# EasyEDA schematic 1-Schematic_Purple Eye.json
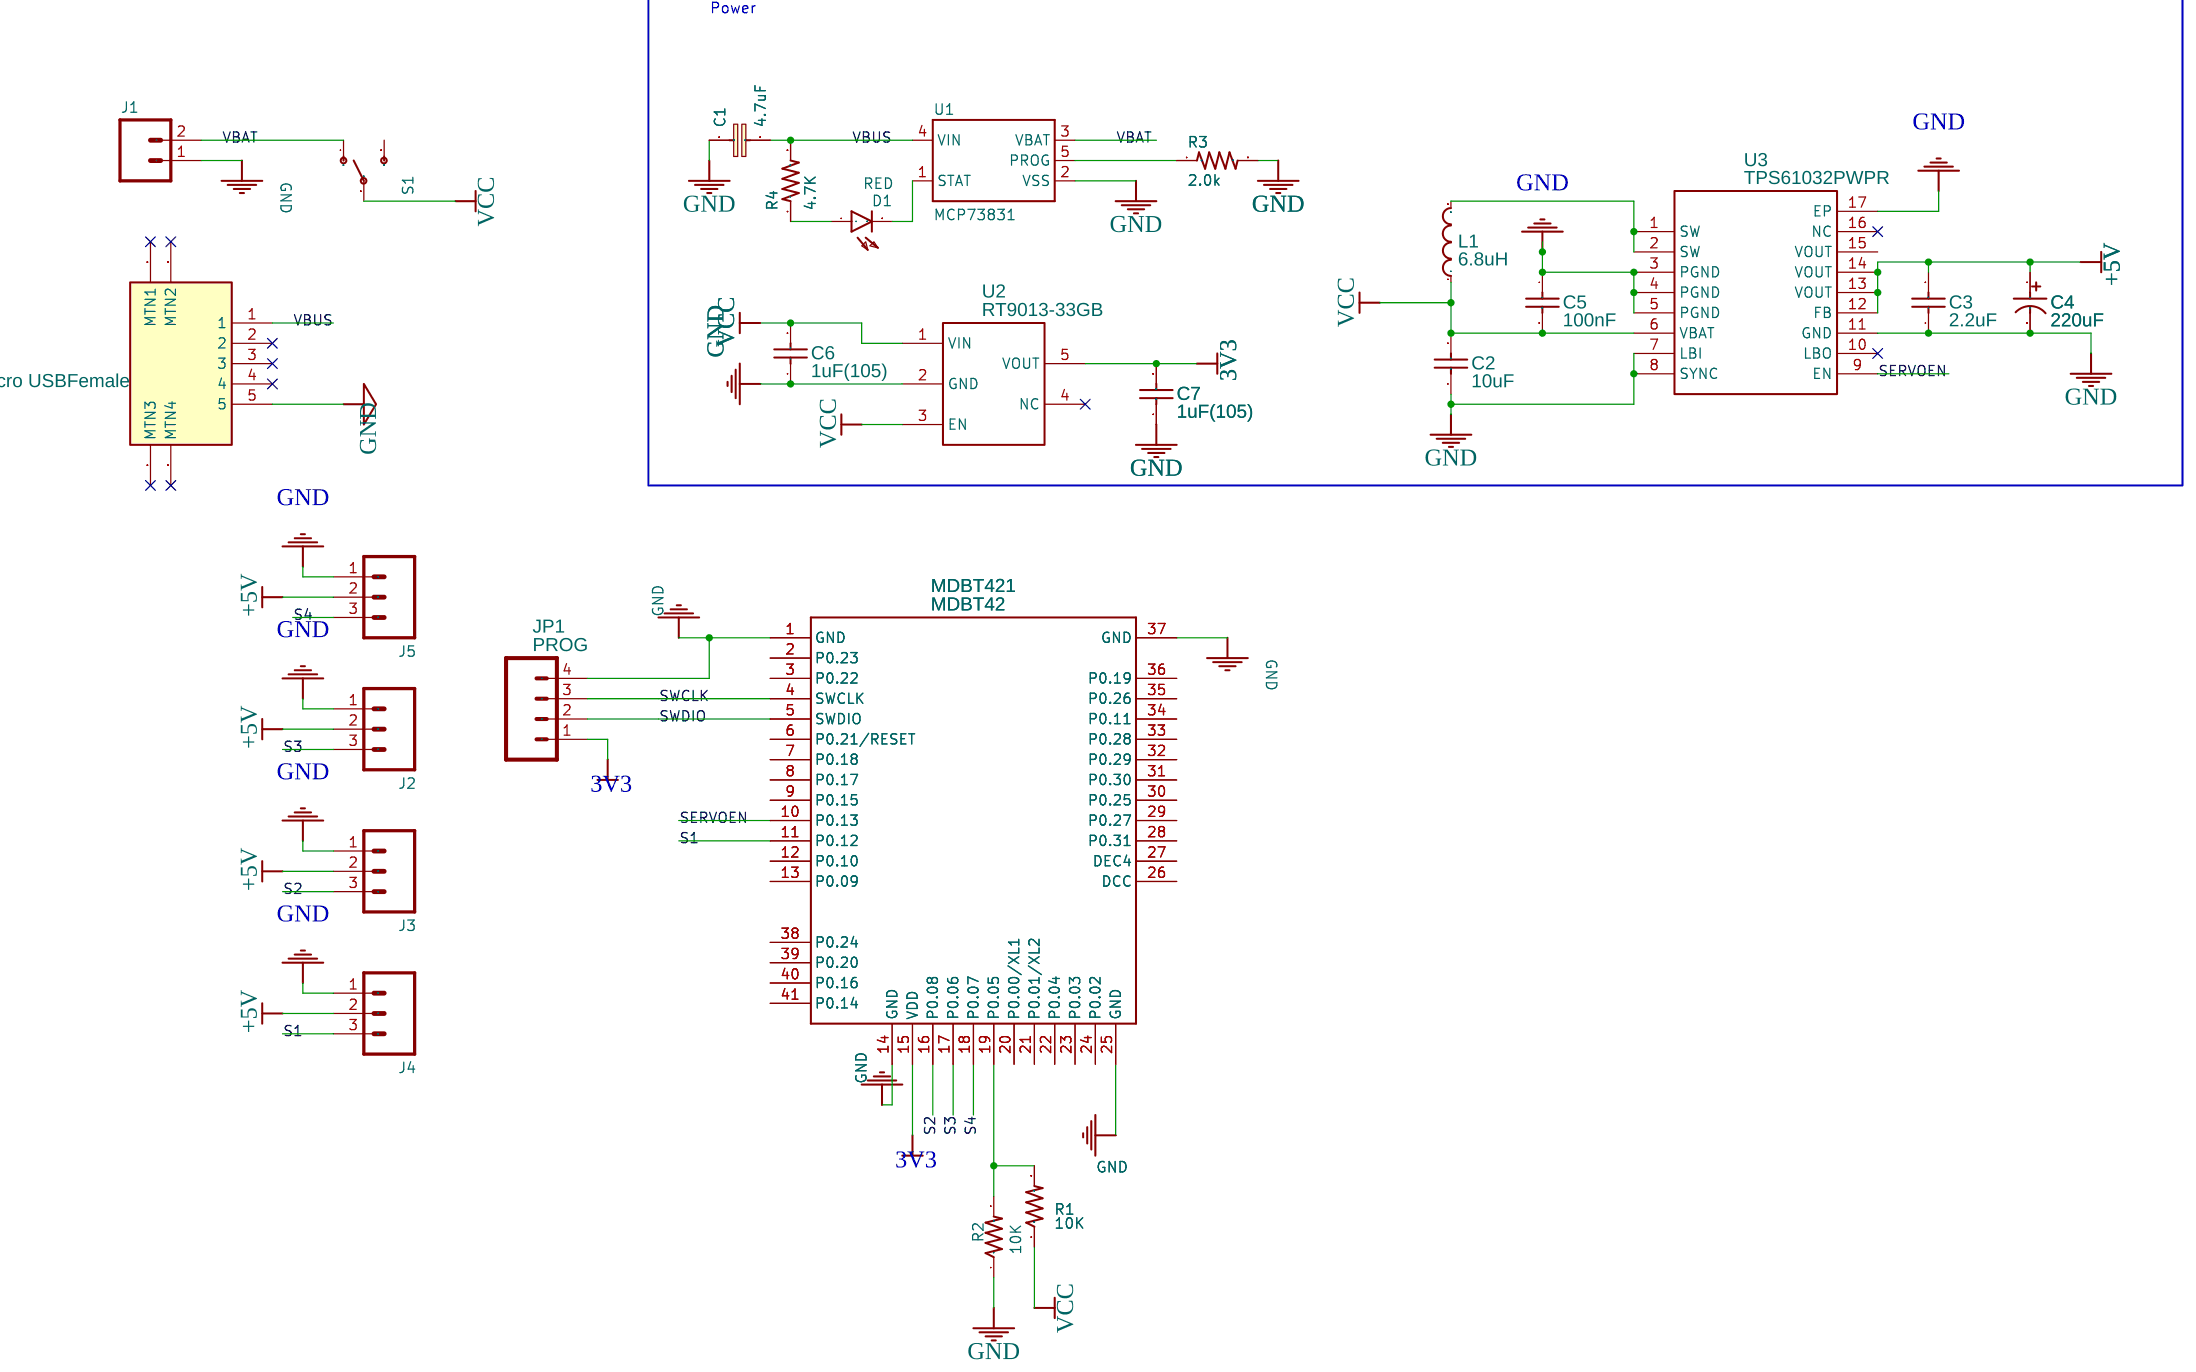
[diagram p0: schematic sheet]

## Parts
C1  4.7uF  [0603]
C2  10uF  [0603]
C3  2.2uF  [0603]
C4  220uF  [CASE-C_6032]
C5  100nF  [0603]
C6  1uF(105)  [0603]
C7  1uF(105)  [0603]
D1  RED  [LED_0603]
J1  M02JST-PTH-2  [JST-2-PTH]
J2  M03LOCK  [1X03_LOCK]
J3  M03LOCK  [1X03_LOCK]
J4  M03LOCK  [1X03_LOCK]
J5  M03LOCK  [1X03_LOCK]
J7  micro USBFemale  [MICRO-USB-1]
JP1  PROG  [1X04_LOCK]
L1  6.8uH  [CDRH103]
MDBT421  MDBT42  [MDBT42]
R1  10K  [0603]
R2  10K  [0603]
R3  2.0k  [0603]
R4  4.7K  [0603]
S1  SWITCH-SPDTPTH_LOCK  [SWITCH-SPDT_LOCK.007S]
U1  MCP73831  [SOT23-5]
U2  RT9013-33GB  [SOT-23-5]
U3  TPS61032PWPR  [HTSSOP-16]

## Library data of the parts
C2 = CL10A475MQ8NNNC: Supplier: LCSC; Manufacturer: SAMSUNG; Contributor: LCSC; Supplier Part: C154959
C3 = CL10A225KP8NNNC: Supplier: LCSC; Manufacturer: SAMSUNG; Supplier Part: C1607
C4 = T491C227K006AT: Supplier: LCSC; Manufacturer: KEMET; Contributor: LCSC; Supplier Part: C117035
C5 = C0603C104K5RACTU: Supplier: LCSC; Manufacturer: KEMET; Contributor: LCSC; Supplier Part: C127833
C6 C7 = 0603B105K160: Supplier: LCSC; Manufacturer: WTC; Contributor: LCSC; Supplier Part: C108463
J7 = -: Supplier: LCSC; Manufacturer: ValuePro; image: //image.lceda.cn/szlcsc/C10418.jpg; Supplier Part: C10418
JP1 = -: Header 4; Contributor: SparkFun; Manufacturer Part: ?
L1 = CDRH103RNP-6R8NC-B: Supplier: LCSC; Manufacturer: Sumida; Contributor: LCSC; Supplier Part: C167253
MDBT421 = -: Contributor: ruslan.khudyakov; Manufacturer Part: ?
U2 = -: Supplier: LCSC; Manufacturer: RICHTEK; image: //image.lceda.cn/szlcsc/C47773.jpg; Supplier Part: C47773
U3 = -: Supplier: LCSC; Manufacturer: TI; Supplier Part: C88716

## Nets
3V3: C7.2 JP1.1 MDBT421.15(VDD) U2.5(VOUT)
+5V: C3.2 C4.1 J2.2 J3.2 J4.2 J5.2 U3.12(FB) U3.13(VOUT) U3.14(VOUT)
GND: C1.1 C2.1 C3.1 C4.2 C5.1 C6.1 C7.1 J1.1 J2.1 J3.1 J4.1 J5.1 J7.5 JP1.4 MDBT421.1(GND) MDBT421.14(GND) MDBT421.25(GND) MDBT421.37(GND) R2.1 R3.2 U1.2(VSS) U2.2(GND) U3.3(PGND) U3.4(PGND) U3.5(PGND) U3.7(LBI) U3.8(SYNC) U3.11(GND) U3.17(EP)
VBAT: J1.2 S1.1(O) U1.3(VBAT)
VBUS: C1.2 J7.1 R4.2 U1.4(VIN)
VCC: C2.2 C5.2 C6.2 L1.1 R1.1 S1.2(P) U2.1(VIN) U2.3(EN) U3.6(VBAT)
S1: J4.3 MDBT421.11(P0.12)
S2: J3.3 MDBT421.16(P0.08)
S3: J2.3 MDBT421.17(P0.06)
S4: J5.3 MDBT421.18(P0.07)
SERVOEN: MDBT421.10(P0.13) U3.9(EN)
SWCLK: JP1.3 MDBT421.4(SWCLK)
SWDIO: JP1.2 MDBT421.5(SWDIO)
D1_1: D1.1(A) R4.1
R1_2: MDBT421.19(P0.05) R1.2 R2.2
U1_1: D1.2(C) U1.1(STAT)
U1_5: R3.1 U1.5(PROG)
U3_1: L1.2 U3.1(SW) U3.2(SW)

Not connected (* = marked no-connect by the designer): J7 0(MTN1)* 2* 3* 4*; MDBT421 2(P0.23) 3(P0.22) 6(P0.21/RESET) 7(P0.18) 8(P0.17) 9(P0.15) 12(P0.10) 13(P0.09) 20(P0.00/XL1) 21(P0.01/XL2) 22(P0.04) 23(P0.03) 24(P0.02) 26(DCC) 27(DEC4) 28(P0.31) 29(P0.27) 30(P0.25) 31(P0.30) 32(P0.29) 33(P0.28) 34(P0.11) 35(P0.26) 36(P0.19) 38(P0.24) 39(P0.20) 40(P0.16) 41(P0.14); S1 3(S); U2 4(NC)*; U3 10(LBO)* 15(VOUT) 16(NC)*

## Notes on the sheet
- Power
